# EAGLE design can2usb_v1.3 (EAGLE 5.02)
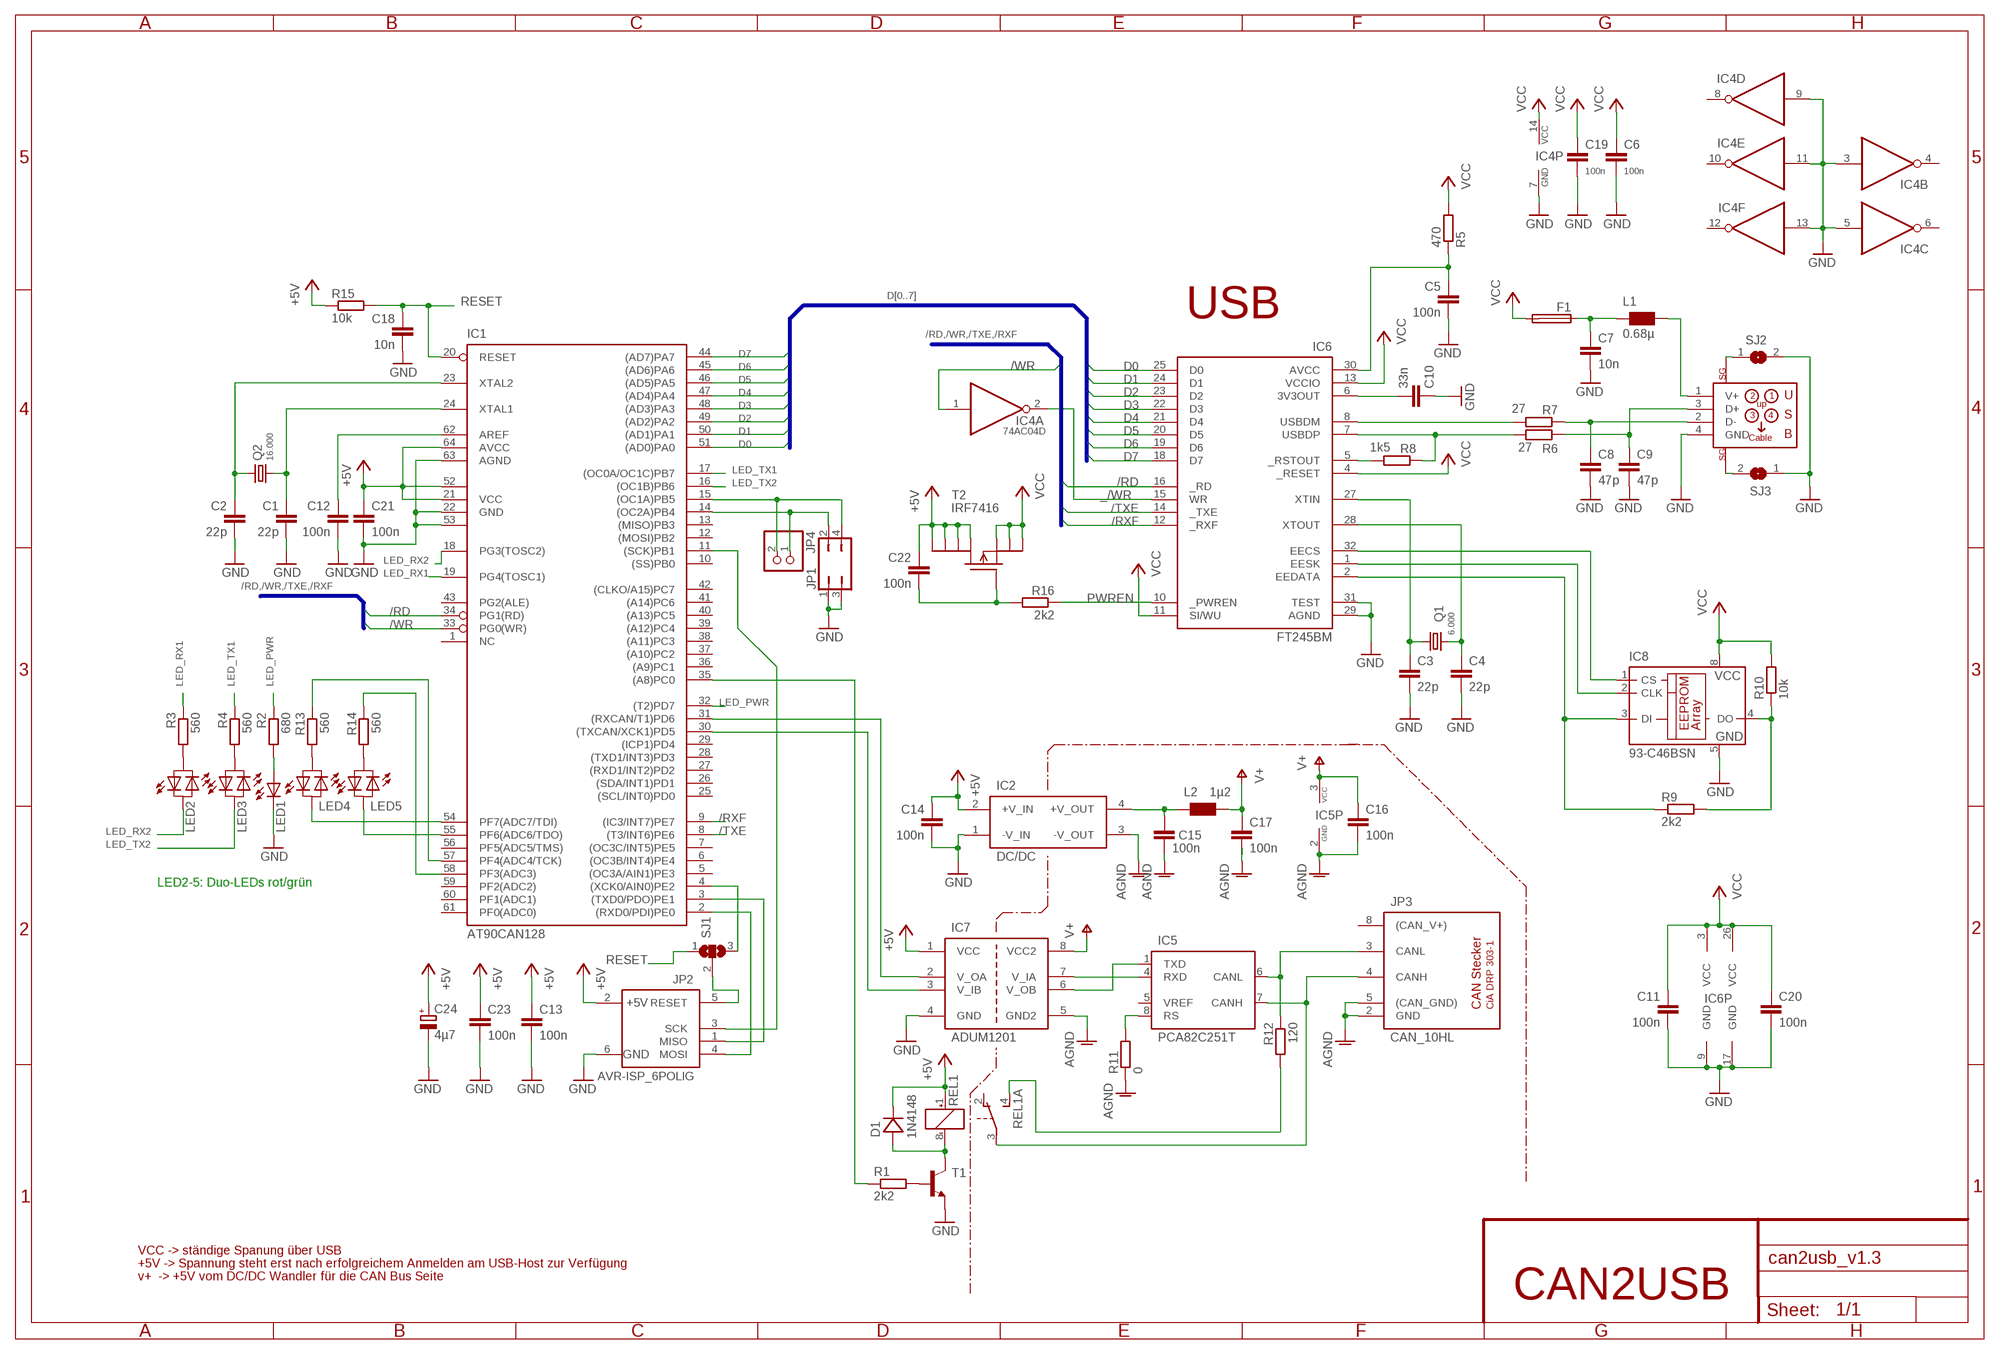
[diagram p0: schematic, sheet 1]

## Parts
C1  22p  C-EUC0805  [C0805]
C2  22p  C-EUC0805  [C0805]
C3  22p  C-EUC0805  [C0805]
C4  22p  C-EUC0805  [C0805]
C5  100n  C-EUC0805  [C0805]
C6  100n  C-EUC0805  [C0805]
C7  10n  C-EUC0805  [C0805]
C8  47p  C-EUC0805  [C0805]
C9  47p  C-EUC0805  [C0805]
C10  33n  C-EUC0805  [C0805]
C11  100n  C-EUC0805  [C0805]
C12  100n  C-EUC0805  [C0805]
C13  100n  C-EUC0805  [C0805]
C14  100n  C-EUC0805  [C0805]
C15  100n  C-EUC0805  [C0805]
C16  100n  C-EUC0805  [C0805]
C17  100n  C-EUC0805  [C0805]
C18  10n  C-EUC0805  [C0805]
C19  100n  C-EUC0805  [C0805]
C20  100n  C-EUC0805  [C0805]
C21  100n  C-EUC0805  [C0805]
C22  100n  C-EUC0805  [C0805]
C23  100n  C-EUC0805  [C0805]
C24  4µ7  CPOL-EU153CLV-0505  [153CLV-0505]
D1  1N4148  DIODESOD80C  [SOD80C]
F1  FUSE  [SMD-HASF]
IC1  AT90CAN128  AT90CAN128B  [SQFP-S-14X14-64]
IC2  DC/DC  [SIL4]
IC4  74AC04D  [SO14]
IC5  PCA82C251T  PCA82C250T  [SO08]
IC6  FT245BM  [LQFP-32]
IC7  ADUM1201  [SO08]
IC8  93-C46BSN  [SO-08]
JP1  JP2Q  [JP2Q]
JP2  AVR-ISP_6POLIG  [2X03]
JP3  CAN_10HL  [ML10L]
JP4  PINHD-1X2S  [1X02S]
L1  0.68µ  WE-KI_0805_B  [WE-KI_0805_B]
L2  1µ2  WE-KI_0805_B  [WE-KI_0805_B]
LED1  LED3MM  [LED3MM]
LED2  DUOLED  [LED3MM]
LED3  DUOLED  [LED3MM]
LED4  DUOLED  [LED3MM]
LED5  DUOLED  [LED3MM]
Q1  6.000  CRYTALSM49  [SM49]
Q2  16.000  CRYTALHC49U-V  [HC49U-V]
R1  2k2  R-EU_M0805  [M0805]
R2  680  R-EU_M0805  [M0805]
R3  560  R-EU_M0805  [M0805]
R4  560  R-EU_M0805  [M0805]
R5  470  R-EU_R0805  [R0805]
R6  27  R-EU_M0805  [M0805]
R7  27  R-EU_M0805  [M0805]
R8  1k5  R-EU_M0805  [M0805]
R9  2k2  R-EU_M0805  [M0805]
R10  10k  R-EU_M0805  [M0805]
R11  0  R-EU_M0805  [M0805]
R12  120  R-EU_R1206  [R1206]
R13  560  R-EU_M0805  [M0805]
R14  560  R-EU_M0805  [M0805]
R15  10k  R-EU_M0805  [M0805]
R16  2k2  R-EU_M0805  [M0805]
REL1  REL_2XUMDIL08SMD  [DIL08SMD]
SJ1  SJ2W  [SJ_2]
SJ2  SJ  [SJ]
SJ3  SJ  [SJ]
T1  NPNSOT23  [SOT23]
T2  IRF7416  MOSFET_P-KANAL_V1SO08  [SO08]
X1  USBCON-BB  [USBCONB]

## Nets
+5V: C13.1 C14.1 C21.1 C22.1 C23.1 C24.+ D1.C(C1) IC1.21(VCC) IC1.52(VCC1) IC1.64(AVCC) IC2.2(+V_IN) IC7.1(VCC) JP2.2(+5V) R15.1 REL1.1(SPULE:+) T2.5(D1) T2.6(D2) T2.7(D3) T2.8(D4)
/RD: IC1.34(PG1(RD)) IC6.16(_RD)
/RXF: IC1.9((IC3/INT7)PE7) IC6.12(_RXF)
/TXE: IC1.8((T3/INT6)PE6) IC6.14(_TXE)
/WR: IC1.33(PG0(WR)) IC4.1(A:I)
_/WR: IC4.2(A:O) IC6.15(WR)
_RXD: IC5.4(RXD) IC7.7(V_IA)
_TXD: IC5.1(TXD) IC7.6(V_OB)
AGND: C15.2 C16.2 C17.2 IC2.3(-V_OUT) IC5.2(GND) IC7.5(GND2) JP3.2(GND) JP3.5((CAN_GND)) R11.1
CANH: IC5.7(CANH) JP3.4(CANH) REL1.3(A:P)
CANL: IC5.6(CANL) JP3.3(CANL) R12.1
D0: IC1.51((AD0)PA0) IC6.25(D0)
D1: IC1.50((AD1)PA1) IC6.24(D1)
D2: IC1.49((AD2)PA2) IC6.23(D2)
D3: IC1.48((AD3)PA3) IC6.22(D3)
D4: IC1.47((AD4)PA4) IC6.21(D4)
D5: IC1.46((AD5)PA5) IC6.20(D5)
D6: IC1.45((AD6)PA6) IC6.19(D6)
D7: IC1.44((AD7)PA7) IC6.18(D7)
DM: C8.1 R7.1 X1.2(D-)
DP: C9.1 R6.1 X1.3(D+)
GND: C1.2 C2.2 C3.2 C4.2 C5.2 C6.2 C7.2 C8.2 C9.2 C10.1 C11.2 C12.2 C13.2 C14.2 C18.2 C19.2 C20.2 C21.2 C23.2 C24.- IC1.22(GND) IC1.53(GND1) IC1.63(AGND) IC2.1(-V_IN) IC4.3(B:I) IC4.5(C:I) IC4.7(P:GND) IC4.9(D:I) IC4.11(E:I) IC4.13(F:I) IC6.9(GND) IC6.17(GND) IC6.29(AGND) IC6.31(TEST) IC7.4(GND) IC8.5(GND) JP1.1 JP1.3 JP2.6(GND) LED1.K(C) SJ2.2 SJ3.1 T1.2(E) X1.4(GND)
LED_ERROR: IC1.57(PF4(ADC4/TCK)) R13.1
LED_OK: IC1.58(PF3(ADC3)) R14.1
LED_PWR: IC1.32((T2)PD7) R2.1
LED_RX1: IC1.19(PG4(TOSC1)) R3.1
LED_RX2: IC1.18(PG3(TOSC2)) LED2.K(C)
LED_TX1: IC1.17((OC0A/OC1C)PB7) R4.1
LED_TX2: IC1.16((OC1B)PB6) LED3.K(C)
MISO: IC1.3((TXD0/PDO)PE1) JP2.1(MISO)
N$1: JP2.5(RESET) SJ1.2
N$2: L1.1 X1.1(V+)
N$3: C22.2 R16.2 T2.4(G)
N$4: IC1.4((XCK0/AIN0)PE2) SJ1.3
N$5: R12.2 REL1.4(A:S)
N$6: D1.A(A1) REL1.8(SPULE:-) T1.3(C)
N$7: R1.2 T1.1(B)
N$8: C2.1 IC1.23(XTAL2) Q2.2
N$9: IC1.35((A8)PC0) R1.1
N$10: C1.1 IC1.24(XTAL1) Q2.1
N$11: C4.1 IC6.28(XTOUT) Q1.2
N$12: LED4.A R13.2
N$13: C3.1 IC6.27(XTIN) Q1.1
N$14: LED5.A R14.2
N$15: LED1.A R2.2
N$16: IC1.55(PF6(ADC6/TDO)) LED5.K(C)
N$17: IC1.54(PF7(ADC7/TDI)) LED4.K(C)
N$18: IC5.8(RS) R11.2
N$19: SJ2.1 X1.S2
N$20: SJ3.2 X1.S1
N$21: C7.1 F1.1 L1.2
N$22: C15.1 IC2.4(+V_OUT) L2.2
N$23: IC6.32(EECS) IC8.1(CS)
N$24: IC6.1(EESK) IC8.2(CLK)
N$25: IC8.4(DO) R9.2 R10.1
N$26: IC6.2(EEDATA) IC8.3(DI) R9.1
N$27: IC1.11((SCK)PB1) JP2.3(SCK)
N$28: C5.1 IC6.30(AVCC) R5.1
N$29: IC1.2((RXD0/PDI)PE0) JP2.4(MOSI)
N$30: C12.1 IC1.62(AREF)
N$31: IC6.8(USBDM) R7.2
N$32: IC6.7(USBDP) R6.2 R8.1
N$33: LED3.A R4.2
N$34: LED2.A R3.2
N$37: IC6.5(_RSTOUT) R8.2
N$38: C10.2 IC6.6(3V3OUT)
PWREN: IC6.10(_PWREN) R16.1
RESET: C18.1 IC1.20(RESET) R15.2 SJ1.1
RXCAN: IC1.31((RXCAN/T1)PD6) IC7.2(V_OA)
SW1: IC1.14((OC2A)PB4) JP1.2 JP4.1
SW2: IC1.15((OC1A)PB5) JP1.4 JP4.2
TXCAN: IC1.30((TXCAN/XCK1)PD5) IC7.3(V_IB)
V+: C16.1 C17.1 IC5.3(VCC) IC7.8(VCC2) L2.1
VCC: C6.1 C11.1 C19.1 C20.1 F1.2 IC4.14(P:VCC) IC6.3(VCC) IC6.4(_RESET) IC6.11(SI/WU) IC6.13(VCCIO) IC6.26(VCC) IC8.8(VCC) R5.2 R10.2 T2.1(S1) T2.2(S2) T2.3(S3)
Unconnected: IC1.1(NC) IC1.5((OC3A/AIN1)PE3) IC1.6((OC3B/INT4)PE4) IC1.7((OC3C/INT5)PE5) IC1.10((SS)PB0) IC1.12((MOSI)PB2) IC1.13((MISO)PB3) IC1.25((SCL/INT0)PD0) IC1.26((SDA/INT1)PD1) IC1.27((RXD1/INT2)PD2) IC1.28((TXD1/INT3)PD3) IC1.29((ICP1)PD4) IC1.36((A9)PC1) IC1.37((A10)PC2) IC1.38((A11)PC3) IC1.39((A12)PC4) IC1.40((A13)PC5) IC1.41((A14)PC6) IC1.42((CLKO/A15)PC7) IC1.43(PG2(ALE)) IC1.56(PF5(ADC5/TMS)) IC1.59(PF2(ADC2)) IC1.60(PF1(ADC1)) IC1.61(PF0(ADC0)) IC4.4(B:O) IC4.6(C:O) IC4.8(D:O) IC4.10(E:O) IC4.12(F:O) IC5.5(VREF) JP3.8((CAN_V+)) REL1.2(A:O) REL1.5(B:S) REL1.6(B:P) REL1.7(B:O)

## Buses
D[0..7]
/RD,/WR,/TXE,/RXF

## Notes on the sheet
- USB
- LED2-5: Duo-LEDs rot/grün
- VCC -> ständige Spanung über USB
- +5V -> Spannung steht erst nach erfolgreichem Anmelden am USB-Host zur Verfügung
- v+  -> +5V vom DC/DC Wandler für die CAN Bus Seite
- CAN2USB

## Library data of the parts
C1-C23 = rcl:C-EU: CAPACITOR, European symbol
C24 = rcl:CPOL-EU: POLARIZED CAPACITOR, European symbol
D1 = BV_dioden:DIODE
F1 = rca_sontiges:FUSE: SMD Fuse
IC1 = avr:AT90CAN128: MICROCONTROLLER 128 Kbytes FLASH 4 Kbytes SRAM 4 Kbytes EEPROM DUAL USART 8-channel 10 bit ADC CAN 2.0 A&B Interface
IC2 = rca_spgversorgung:DC/DC
IC4 = 74xx-eu:74*04: Hex INVERTER
IC5 = andereBauteile:PCA82C250: PCA82C250 CAN Bustreiber
IC6 = ftdi:FT245BM: USB FIFO 2nd Generation USB FIFO (USB <-> Parallel)
IC7 = rca_opto:ADUM1201: ADuM1201 Dual-Channel Digital Isolators zu beziehen per Sample oder bei Farnell
IC8 = microchip:93-*: Serial EEPROM 512 x 8 bit/256 x 16 bit/1 K/4 K, 5.0 V, Microwire
JP1 = jumper:JP2Q: JUMPER
JP2 = stecker-definitionen:AVR-ISP_6POLIG: ISP (In System Programming) Stecker für AVRs Über diesen Anschluß kann ein AVR mit einem Standard ISP-Kabel direkt an einen Parallelport des PC´s angeschlossen und programmiert werden.
JP3 = stecker-definitionen:CAN_: CAN Stecker nach CiA DRP 303-1
JP4 = pinhead:PINHD-1X2: PIN HEADER
L1 L2 = wuerth-elektronik:WE-KI: SMD Wire Wound Ceramic Inductor WE-KI - Wire wound - High thermal stability - Rated current up to 1 A - High Q-factor - High SRF -- Especially developed for high frequency applications -- Perfect for applications in telecommunications -- Bluetooth -- Wireless LAN
LED1 = led:LED: LED OSRAM: - CHIPLED LG R971, LG N971, LY N971, LG Q971, LY Q971, LO R971, LY R971 LH N974, LH R974 LS Q976, LO Q976, LY Q976 LO Q996 - Hyper CHIPLED LW Q18S LB Q993, LB Q99A, LB R99A - SideLED LS A670, LO A670, LY A670, LG A670, LP A670 LB A673, LV A673, LT A673, LW A673 LH A674 LY A675 LS A676, LA A676, LO A676, LY A676, LW A676 LS A679, LY A679, LG A679 - Hyper Micro SIDELED® LS Y876, LA Y876, LO Y876, LY Y876 LT Y87S - SmartLED LW L88C, LW L88S LB L89C, LB L89S, LG L890 LS L89K, LO L89K, LY L89K LS L896, LA L896, LO L896, LY L896 - TOPLED LS T670, LO T670, LY T670, LG T670, LP T670 LSG T670, LSP T670, LSY T670, LOP T670, LYG T670 LG T671, LOG T671, LSG T671 LB T673, LV T673, LT T673, LW T673 LH T674 LS T676, LA T676, LO T676, LY T676, LB T676, LH T676, LSB T676, LW T676 LB T67C, LV T67C, LT T67C, LS T67K, LO T67K, LY T67K, LW E67C LS E67B, LA E67B, LO E67B, LY E67B, LB E67C, LV E67C, LT E67C LW T67C LS T679, LY T679, LG T679 LS T770, LO T770, LY T770, LG T770, LP T770 LB T773, LV T773, LT T773, LW T773 LH T774 LS E675, LA E675, LY E675, LS T675 LS T776, LA T776, LO T776, LY T776, LB T776 LHGB T686 LT T68C, LB T68C - Hyper Mini TOPLED® LB M676 - Mini TOPLED Santana® LG M470 LS M47K, LO M47K, LY M47K Source: http://www.osram.convergy.de - LUMILED® LXK2-PW12-R00, LXK2-PW12-S00, LXK2-PW14-U00, LXK2-PW14-V00 LXK2-PM12-R00, LXK2-PM12-S00, LXK2-PM14-U00 LXK2-PE12-Q00, LXK2-PE12-R00, LXK2-PE12-S00, LXK2-PE14-T00, LXK2-PE14-U00 LXK2-PB12-K00, LXK2-PB12-L00, LXK2-PB12-M00, LXK2-PB14-N00, LXK2-PB14-P00, LXK2-PB14-Q00 LXK2-PR12-L00, LXK2-PR12-M00, LXK2-PR14-Q00, LXK2-PR14-R00 LXK2-PD12-Q00, LXK2-PD12-R00, LXK2-PD12-S00 LXK2-PH12-R00, LXK2-PH12-S00 LXK2-PL12-P00, LXK2-PL12-Q00, LXK2-PL12-R00 Source: www.luxeon.com
LED2-LED5 = rca_opto:DUOLED
Q1 Q2 = crystal:CRYTAL: CRYSTAL
R1-R16 = rcl:R-EU_: RESISTOR, European symbol
REL1 = BV_sonstiges:REL_2XUM
SJ1 = jumper:SJ2W: SMD solder JUMPER
SJ2 SJ3 = jumper:SJ: SMD solder JUMPER
T1 = BV_transistoren:NPN
T2 = BV_transistoren:MOSFET_P-KANAL_V1
X1 = USB:USBCON-B: USB-Contector B-Type

## Board
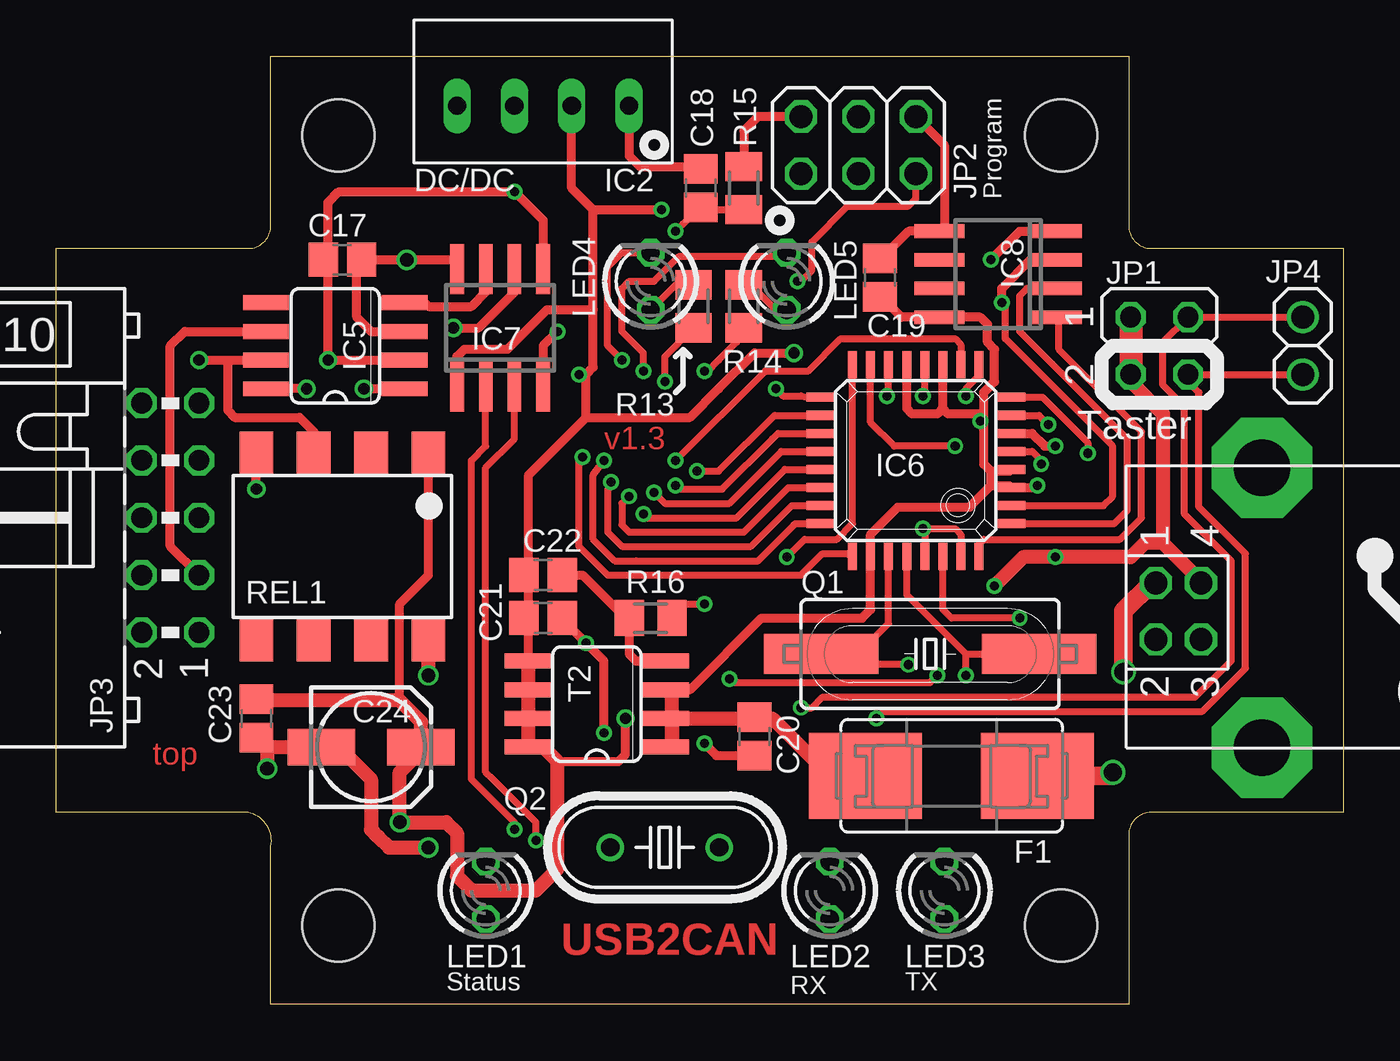
[diagram p1: board, top side]
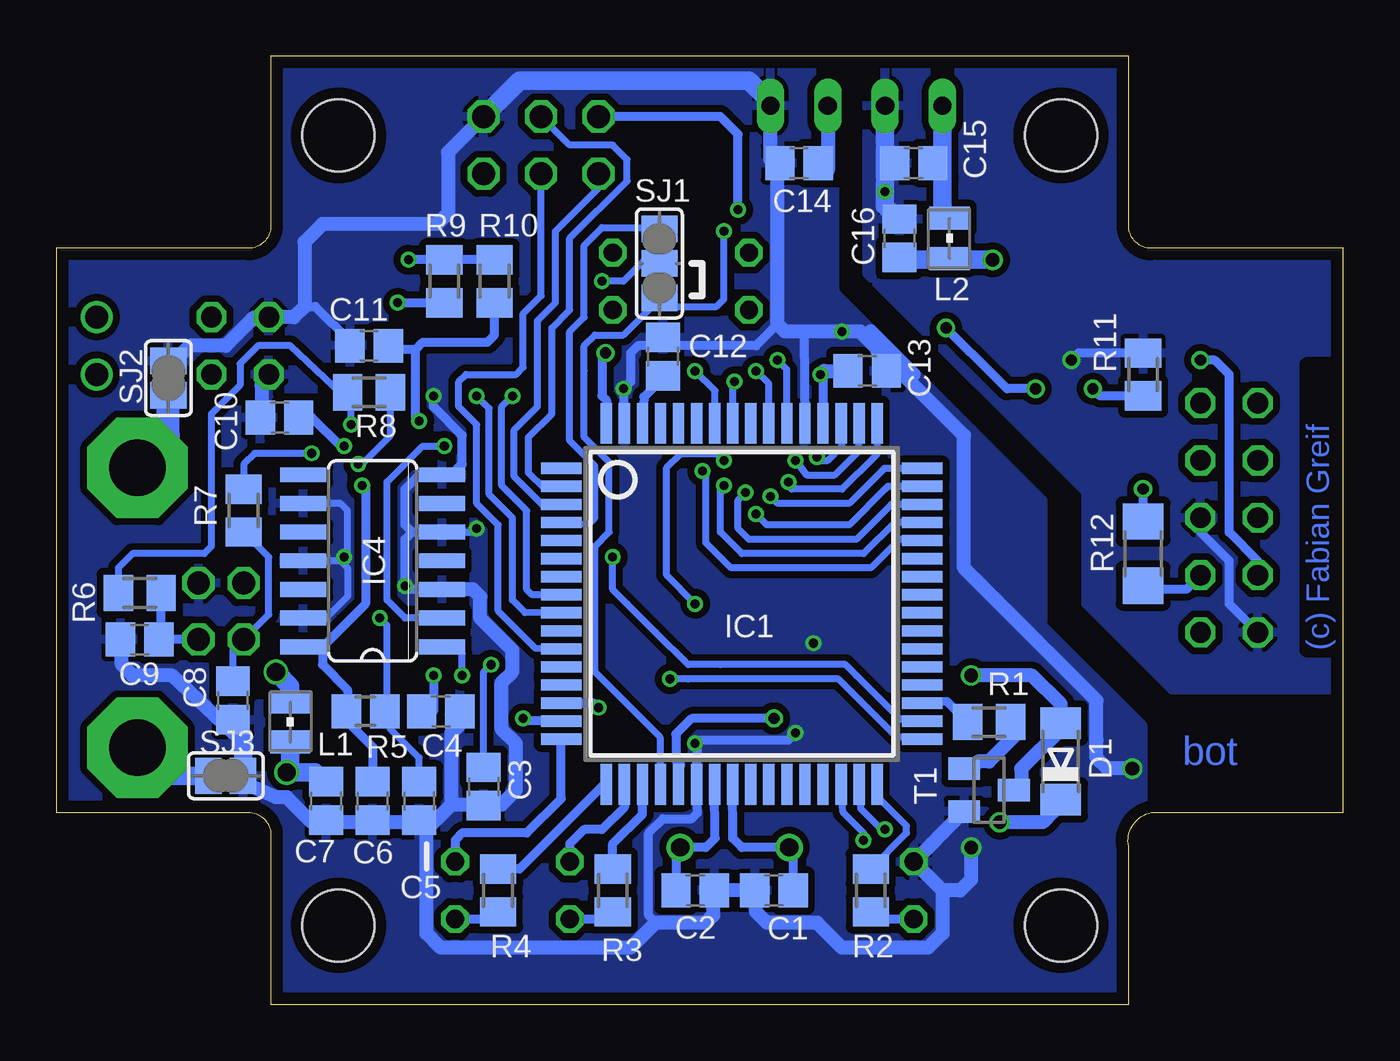
[diagram p2: board, bottom side, seen from below]

Size 57 x 42 mm. Coordinates in mm from the lower left corner, seen from the top.
Outline: 0,33.5 8.5,33.5 arc90 9.5,34.5 9.5,42 47.5,42 47.5,34.5 arc90 48.5,33.5 57,33.5 57,8.5 48.5,8.5 arc90 47.5,7.5 47.5,0 9.5,0 9.5,7 arc90 8.5,8.5 0,8.5 0,33.5
Copper layers (1*16): Top 0.035mm / dielectric 1.5mm / Bottom 0.035mm
Design rules "PCB-POOL": minimum track width 6mil, minimum drill 12mil, track to track 6mil, track to pad 6mil, pad to pad 6mil, via to via 6mil, smd to smd 6mil, copper to edge 20mil, drill to drill 8mil, minimum pad ring 8mil, minimum via ring 6mil, stop-mask expansion 3mil, vias tented up to drill 20mil, thermal gap 8mil
Holes 3.2 mm at 12.5,38.5 44.5,38.5 12.5,3.5 44.5,3.5

### Footprints (pad centres in the part's own frame; a part is rotated, then mirrored left to right if it is on the bottom)
C0805 = smd 1.3 x 1.5: 1 -0.85,0; 2 0.85,0
153CLV-0505 = smd 3 x 1.6: + 2.2,0; - -2.2,0
SOD80C = smd 1.4 x 1.8: A 1.7,0; C -1.7,0
SMD-HASF = smd 5 x 3.81: 1 -3.81,0; 2 3.81,0
SQFP-S-14X14-64 = smd 0.5 x 1.8: 1 -6,-8; 2 -5.2,-8; 3 -4.4,-8; 4 -3.6,-8; 5 -2.8,-8; 6 -2,-8; 7 -1.2,-8; 8 -0.4,-8; 9 0.4,-8; 10 1.2,-8; 11 2,-8; 12 2.8,-8; 13 3.6,-8; 14 4.4,-8; 15 5.2,-8; 16 6,-8; 33 6,8; 34 5.2,8; 35 4.4,8; 36 3.6,8; 37 2.8,8; 38 2,8; 39 1.2,8; 40 0.4,8; 41 -0.4,8; 42 -1.2,8; 43 -2,8; 44 -2.8,8; 45 -3.6,8; 46 -4.4,8; 47 -5.2,8; 48 -6,8 | smd 1.8 x 0.5: 17 8,-6; 18 8,-5.2; 19 8,-4.4; 20 8,-3.6; 21 8,-2.8; 22 8,-2; 23 8,-1.2; 24 8,-0.4; 25 8,0.4; 26 8,1.2; 27 8,2; 28 8,2.8; 29 8,3.6; 30 8,4.4; 31 8,5.2; 32 8,6; 49 -8,6; 50 -8,5.2; 51 -8,4.4; 52 -8,3.6; 53 -8,2.8; 54 -8,2; 55 -8,1.2; 56 -8,0.4; 57 -8,-0.4; 58 -8,-1.2; 59 -8,-2; 60 -8,-2.8; 61 -8,-3.6; 62 -8,-4.4; 63 -8,-5.2; 64 -8,-6
SIL4 = drill 0.813 long: 1 -3.81,0; 2 -1.27,0; 3 1.27,0; 4 3.81,0
SO14 = smd 0.66 x 2.032: 1 -3.81,-3.073; 2 -2.54,-3.073; 3 -1.27,-3.073; 4 0,-3.073; 5 1.27,-3.073; 6 2.54,-3.073; 7 3.81,-3.073; 8 3.81,3.073; 9 2.54,3.073; 10 1.27,3.073; 11 0,3.073; 12 -1.27,3.073; 13 -2.54,3.073; 14 -3.81,3.073
SO08 = smd 0.66 x 2.032: 1 -1.905,-3.073; 2 -0.635,-3.073; 3 0.635,-3.073; 4 1.905,-3.073; 5 1.905,3.073; 6 0.635,3.073; 7 -0.635,3.073; 8 -1.905,3.073
LQFP-32 = smd 0.4 x 1.2: 1 -2.8,-4.25; 2 -2,-4.25; 3 -1.2,-4.25; 4 -0.4,-4.25; 5 0.4,-4.25; 6 1.2,-4.25; 7 2,-4.25; 8 2.8,-4.25; 17 2.8,4.25; 18 2,4.25; 19 1.2,4.25; 20 0.4,4.25; 21 -0.4,4.25; 22 -1.2,4.25; 23 -2,4.25; 24 -2.8,4.25 | smd 1.2 x 0.4: 9 4.25,-2.8; 10 4.25,-2; 11 4.25,-1.2; 12 4.25,-0.4; 13 4.25,0.4; 14 4.25,1.2; 15 4.25,2; 16 4.25,2.8; 25 -4.25,2.8; 26 -4.25,2; 27 -4.25,1.2; 28 -4.25,0.4; 29 -4.25,-0.4; 30 -4.25,-1.2; 31 -4.25,-2; 32 -4.25,-2.8
SO08' = smd 0.6 x 2.2: 1 -1.905,-2.6; 2 -0.635,-2.6; 3 0.635,-2.6; 4 1.905,-2.6; 5 1.905,2.6; 6 0.635,2.6; 7 -0.635,2.6; 8 -1.905,2.6
SO-08 = smd 0.6 x 2.2: 1 -1.905,-2.6; 2 -0.635,-2.6; 3 0.635,-2.6; 4 1.905,-2.6; 5 1.905,2.6; 6 0.635,2.6; 7 -0.635,2.6; 8 -1.905,2.6
JP2Q = drill 0.914 octagon: 1 -1.27,-1.27; 2 -1.27,1.27; 3 1.27,-1.27; 4 1.27,1.27
2X03 = drill 1.016 octagon: 1 -2.54,-1.27; 2 -2.54,1.27; 3 0,-1.27; 4 0,1.27; 5 2.54,-1.27; 6 2.54,1.27
ML10L = drill 0.914 octagon: 1 -5.08,-1.27; 2 -5.08,1.27; 3 -2.54,-1.27; 4 -2.54,1.27; 5 0,-1.27; 6 0,1.27; 7 2.54,-1.27; 8 2.54,1.27; 9 5.08,-1.27; 10 5.08,1.27
1X02S = drill 1.016 round: 1 -1.27,0; 2 1.27,0
WE-KI_0805_B = smd 1.02 x 1.78: 1 -0.89,0; 2 0.89,0
LED3MM = drill 0.813 octagon: A -1.27,0; K 1.27,0
SM49 = smd 5.08 x 1.778: 1 -4.826,0; 2 4.826,0
HC49U-V = drill 0.813 round: 1 -2.413,0; 2 2.413,0
M0805 = smd 1.3 x 1.6: 1 -0.95,0; 2 0.95,0
R0805 = smd 1.3 x 1.5: 1 -0.85,0; 2 0.85,0
R1206 = smd 1.6 x 1.803: 1 -1.422,0; 2 1.422,0
DIL08SMD = smd 1.5 x 1.9: 1 -3.81,-4.15; 2 -1.27,-4.15; 3 1.27,-4.15; 4 3.81,-4.15; 5 3.81,4.15; 6 1.27,4.15; 7 -1.27,4.15; 8 -3.81,4.15
SJ_2 = smd 1.168 x 1.6: 1 -1.524,0; 2 0,0; 3 1.524,0
SJ = smd 1.168 x 1.6: 1 -0.762,0; 2 0.762,0
SOT23 = smd 1 x 1.4: 1 -0.95,-1.1; 2 0.95,-1.1; 3 0,1.1
USBCONB = drill 1.016 octagon: 1 7.3,4.7; 2 4.8,4.7; 3 4.8,2.7; 4 7.3,2.7 | drill 2.5 pad 4.445 octagon: S1 0,0; S2 12.4,0

### Placement (x,y rotation side)
C1  25.21,5.05 180 bottom
C2  28.7,5.05 0 bottom
C3  38.07,9.65 270 bottom
C4  39.97,12.99 0 bottom
C5  40.93,9.02 270 bottom
C6  42.99,9.02 270 bottom
C7  45.05,9.02 270 bottom
C8  49.18,13.46 270 bottom
C9  53.31,16.16 180 bottom
C10  47.12,26 0 bottom
C11  43.15,29.18 180 bottom
C12  30.13,28.7 90 bottom
C13  21.08,28.07 0 bottom
C14  24.1,37.28 180 bottom
C15  19.02,37.28 180 bottom
C16  19.65,33.94 90 bottom
C17  12.67,32.99 180 top
C18  28.54,36.16 90 top
C19  36.48,32.2 90 top
C20  30.92,11.88 270 top
C21  21.56,17.11 0 top
C22  21.56,19.02 0 top
C23  8.86,12.67 270 top
C24  13.94,11.4 0 top
D1  12.51,10.76 90 bottom
F1  39.66,10.13 180 top
IC1  26.64,17.75 270 bottom
IC2  21.56,39.82 180 top
IC4  42.99,19.65 90 bottom
IC5  12.35,29.18 90 top
IC6  38.07,24.1 90 top
IC7  ADUM1201  [SO08']  19.65,29.97 0 top
IC8  41.72,32.35 90 top
JP1  48.86,29.18 270 top
JP2  35.53,38.07 0 top
JP3  5.05,21.56 90 top
JP4  55.21,29.18 270 top
L1  46.64,12.51 270 bottom
L2  17.43,33.94 90 bottom
LED1  19.02,5.05 90 top
LED2  34.26,5.05 90 top
LED3  39.34,5.05 90 top
LED4  26.32,32.04 90 top
LED5  32.35,32.04 90 top
Q1  38.7,15.53 0 top
Q2  26.96,6.95 0 top
R1  15.69,12.51 0 bottom
R2  20.92,5.05 270 bottom
R3  32.35,5.05 270 bottom
R4  37.43,5.05 270 bottom
R5  43.31,12.99 180 bottom
R6  53.31,18.23 180 bottom
R7  48.7,21.88 90 bottom
R8  43.15,27.12 0 bottom
R9  39.81,32.04 90 bottom
R10  37.59,32.04 270 bottom
R11  8.86,27.91 270 bottom
R12  8.86,19.97 90 bottom
R13  28.23,30.93 90 top
R14  30.45,30.93 90 top
R15  30.45,36.16 270 top
R16  26.32,17.11 180 top
REL1  12.67,20.29 180 top
SJ1  30.29,32.83 90 bottom
SJ2  52.04,27.75 90 bottom
SJ3  49.5,10.13 180 bottom
T1  15.68,9.49 270 bottom
T2  23.94,13.3 90 top
X1  53.41,11.37 90 top

### Tracks (layer width: path | path; a pad name or v marks a point on that pad's centre or on a via)
+5V  (via drill 0.4, 0.5, 0.6)
  Top 0.406: REL1.1 16.48,19.02 15.21,17.75 15.21,13.46 | v25.21,12.67 25.21,12.19 25.21,11.08 24.89,10.76 22.19,10.76 | v25.21,12.67 | 23.46,27.91 23.78,28.23 23.78,30.77 | 23.78,30.77 23.78,35.21 | 23.78,35.21 22.83,36.16 IC2.2 22.83,40.13 | 20.92,15.21 20.92,16.8 20.61,17.11 C21.1 20.92,17.11 20.92,19.02 | 23.46,26 23.46,27.91 | 23.46,27.91 v23.15,27.91 | 29.34,27.27 28.07,26 23.46,26 | 29.34,27.27 | 29.34,27.27 30.92,28.86 v32.67,28.86 | C22.1 20.71,19.23 20.92,19.02 | 20.92,19.02 20.92,23.46 23.46,26 | 8.86,13.46 C23.1 | JP2.2 31.08,39.34 30.45,38.7 R15.1 | 23.78,35.21 v26.8,35.21 | IC7.1 17.75,28.7 18.07,29.02 19.97,29.02 21.72,30.77 23.78,30.77
  Top 0.61: 20.92,11.4 T2.8 | 20.92,11.4 20.92,12.67 | 20.92,12.67 T2.7 | 20.92,12.67 20.92,13.94 | 20.92,13.94 T2.6 | T2.5 20.92,15.21 20.92,13.94 | 20.92,11.4 21.56,11.4 22.19,10.76 22.19,6 21.24,5.05 18.38,5.05 17.75,5.68 17.75,7.59 17.27,8.06 v15.21,8.06 15.21,10.29 16.32,11.4 C24.+ 16.14,11.53 16.16,11.56 16.16,12.51 15.21,13.46 8.86,13.46
  Bottom 0.406: v25.21,12.67 28.86,12.67 29.55,11.98 29.55,10.82 29.34,10.6 29.39,10.55 IC1.21 | IC1.52 23.04,27.8 v23.15,27.91 23.1,27.86 | IC1.64 32.64,26.76 32.83,26.96 32.83,28.7 32.7,28.83 32.64,28.83 v32.67,28.86 | v26.8,35.21 26.8,38.54 27.59,39.34 JP2.2
  Bottom 0.61: C14.1 23.25,37.01 22.83,36.96 IC2.2 | D1.C 12.83,8.54 13.3,8.06 v15.21,8.06 | C13.1 22.99,28.07 v23.15,27.91
/RD  (via drill 0.4)
  Top 0.305: IC6.16 35.27,21.3 34.58,20.61 33.15,20.61 v32.35,19.81
  Bottom 0.305: IC1.34 19.62,12.63 21.56,14.57 22.03,15.05 27.59,15.05 29.02,15.05 30.45,16.48 31.72,17.75 32.35,18.38 | 32.35,18.38 v32.35,19.81 | 32.35,18.38
/RXF  (via drill 0.4)
  Top 0.305: IC6.12 38.47,27.04 v38.39,26.96
  Bottom 0.305: IC1.9 36.25,17.35 36.8,17.91 36.8,21.56 37.83,22.59 37.83,26.4 v38.39,26.96
/TXE  (via drill 0.4)
  Top 0.305: IC6.14 36.87,27.03 v36.8,26.96
  Bottom 0.305: IC1.8 35.92,18.14 36.16,18.38 36.16,21.88 37.27,22.99 37.27,26.48 v36.8,26.96
/WR  (via drill 0.4)
  Top 0.305: v29.81,14.41 29.97,14.26 33.31,14.26 33.62,14.26 38.7,14.26 v39.02,14.57
  Bottom 0.305: IC1.33 19.78,11.84 22.35,14.41 29.02,14.41 29.5,14.41 v29.81,14.41 | v39.02,14.57 39.02,15.53 39.34,15.84 IC4.1
  Bottom 0.406: IC4.1 39.66,15.84
_/WR  (via drill 0.4)
  Top 0.305: IC6.15 36.07,25.78 37.12,24.73 v39.81,24.73
  Bottom 0.305: 39.34,17.11 IC4.2 41.56,17.11 42.35,17.91 42.35,23.15 40.77,24.73 v39.81,24.73
_RXD
  Top 0.406: IC7.7 19.02,31.56 18.38,30.92 16.48,30.92 16.32,31.08 IC5.4
_TXD  (via drill 0.5)
  Top 0.406: 15.84,27.27 IC5.1 v13.62,27.27 | v17.59,29.97 18.7,29.97 20.29,31.56 IC7.6 20.29,32.67
  Bottom 0.406: v13.62,27.27 14.89,27.27 15.37,27.75 v17.59,29.97
AGND  (via drill 0.4, 0.5)
  Top 0.406: IC5.2 v12.03,28.54 12.03,32.99 | IC7.5 21.56,34.73 v20.29,36 12.51,36 12.03,35.53 12.03,32.99 | 12.03,32.99 C17.2
  Bottom 0.406: IC2.3 20.29,38.7 | JP3.2 5.05,17.75 5.05,19.65 6.32,20.92 JP3.5 | v12.03,28.54 11.72,28.86 9.02,28.86 8.86,28.7 R11.1
  Bottom 0.61: 20.29,36.64 C15.2
  Bottom 0.813: 20.29,38.86 IC2.3 20.29,36.64 v20.29,36 20.29,35.37 19.97,35.05 C16.2
  pour Bottom (isolate 0.305): -1.3,13.94 7.59,13.94 11.4,17.75 11.4,22.67 21.08,32.35 21.08,43.15 -1.3,43.15
CANH  (via drill 0.5)
  Top 0.406: v6.32,28.54 7.59,28.54 | 7.59,28.54 IC5.7 | REL1.3 11.4,25.37 10.76,26 7.91,26 7.59,26.32 7.59,28.54
  Bottom 0.406: v6.32,28.54 5.68,28.54 5.05,27.91 5.05,20.92 3.78,19.65 JP3.4
CANL
  Top 0.406: IC5.6 5.68,29.81 5.05,29.18 5.05,20.29 JP3.3
  Bottom 0.406: R12.1 8.86,18.38 6.95,18.38 JP3.3
D0  (via drill 0.4)
  Top 0.305: IC6.25 35.17,19.85 35.05,19.97 33.94,19.97 32.99,19.02 24.42,19.02 23.15,20.29 23.15,24.1 v23.3,24.26
  Bottom 0.305: IC1.51 22.31,25.48 22.19,25.37 22.19,24.73 22.83,24.1 23.15,24.1 v23.3,24.26
D1  (via drill 0.4)
  Top 0.305: IC6.24 32.73,21.3 32.67,21.24 31.08,19.65 25.69,19.65 24.73,19.65 23.78,20.61 23.78,23.46 v24.26,24.1
  Bottom 0.305: 21.56,24.42 22.51,23.46 23.78,23.46 v24.26,24.1 | 21.56,24.42 21.52,24.45 | IC1.50 21.44,24.54 21.56,24.42
D2  (via drill 0.4)
  Top 0.305: IC6.23 32.58,22.1 30.77,20.29 25.05,20.29 24.42,20.92 24.42,22.83 v24.57,23.15
  Bottom 0.305: 20.76,24.26 22.19,22.83 24.42,22.83 v24.57,23.15 | 20.76,24.26 20.73,24.29 | 20.76,24.26 | IC1.49 20.64,24.38 20.76,24.26
D3  (via drill 0.4)
  Top 0.305: IC6.22 32.42,22.9 30.45,20.92 25.37,20.92 25.05,21.24 25.05,22.19 v25.37,22.51
  Bottom 0.305: 20.42,23.65 21.88,22.19 25.05,22.19 v25.37,22.51 | IC1.48 20.32,23.75 20.42,23.65 | 20.42,23.65 | 20.42,23.65 20.45,23.62
D4  (via drill 0.4)
  Top 0.305: IC6.21 32.27,23.7 30.13,21.56 26.16,21.56 v26,21.72
  Bottom 0.305: 20.29,22.83 21.88,21.24 25.53,21.24 25.69,21.4 v26,21.72 | 20.29,22.83 20.25,22.87 | IC1.47 20.17,22.95 20.29,22.83
D5  (via drill 0.4)
  Top 0.305: IC6.20 32.12,24.5 32.04,24.42 29.81,22.19 26.96,22.19 v26.48,22.67
  Bottom 0.305: 20.13,22.03 20.09,22.08 | 20.13,22.03 21.56,20.61 26.32,20.61 26.8,21.08 26.8,22.35 v26.48,22.67 | 20.13,22.03 | IC1.46 20.02,22.15 20.13,22.03
D6  (via drill 0.4)
  Top 0.305: IC6.19 31.97,25.3 31.72,25.05 29.5,22.83 27.59,22.83 v27.43,22.99
  Bottom 0.305: v27.43,22.99 27.59,22.99 27.59,20.92 26.64,19.97 21.24,19.97 19.86,21.35 IC1.45
D7  (via drill 0.4)
  Top 0.305: IC6.18 31.81,26.1 29.34,23.62 | v28.38,23.62 29.34,23.62 | 29.34,23.62
  Bottom 0.305: IC1.44 18.92,20.5 19.02,20.61 19.65,20.61 20.92,19.34 27.11,19.34 28.23,20.45 28.23,23.3 28.23,23.46 v28.38,23.62
DM
  Bottom 0.305: R7.1 47.59,19.81 47.59,17.27 X1.2 | X1.2 | C8.1 49.18,15.68 X1.2
DP
  Bottom 0.406: X1.3 50.76,16.17 50.77,16.16 52.36,16.16 | 52.36,16.16 C9.1 | R6.1 52.36,16.16
GND  (via drill 0.4, 0.6)
  Top 0.305: 38.47,20.85 IC6.29 | 38.47,20.85 38.7,21.08 39.81,21.08 40.07,20.83 IC6.31 | IC6.17 33.25,26.9 32.99,26.96 32.19,26.96 v31.88,27.27 | IC6.9 40.87,27.85 40.29,27.27 v40.29,26.96 | 38.47,20.85 38.46,20.85 v38.39,21.08
  Top 0.406: v22.19,29.81 21.56,29.18 IC7.4 | C18.2 28.54,37.12 25.84,37.12 25.37,37.59 IC2.1 | v24.26,12.03 24.26,15.21 v23.46,16 22.51,16.95 C21.2 | JP2.6 39.34,38.07 39.34,34.42 39.18,34.26 IC8.5 37.75,34.26 36.48,32.99 | 36.48,32.99 | 36.48,32.99 C19.2 | JP1.3 47.59,27.59 | C20.2 29.23,11.02 v28.7,11.56
  Top 0.61: 50.73,18.67 X1.4 | 50.77,18.7 49.02,20.45 | 47.59,27.59 49.02,26.16 49.02,20.45 | 49.02,20.45 48.23,20.45 47.59,19.81 v44.26,19.81 42.83,19.81 v41.56,18.54 | C23.2 8.91,11.82 9.33,11.4 | 9.33,11.4 C24.- 12.51,11.4 13.94,9.97 13.94,7.75 14.26,7.43 14.73,6.95 v16.48,6.95 | 9.33,11.4 v9.33,10.45
  Top 0.813: 50.77,18.7 50.73,18.67
  Top 1.016: 47.43,30.45 | JP1.1 47.43,30.45 | JP1.3 | JP1.3 47.59,30.29 47.43,30.45
  Bottom 0.305: IC1.63 31.92,25.65 31.88,25.69 | 39.34,20.92 IC4.5 39.97,20.92 38.54,20.92 v38.39,21.08 | 40.93,23.46 39.5,23.46 | IC4.9 44.42,22.19 44.1,21.88 44.1,19.97 44.42,19.65 | 44.42,19.65 IC4.11 | IC4.13 45.05,17.11 44.1,18.07 44.1,19.34 44.42,19.65 | v44.26,19.81 | v44.26,19.81 44.42,19.65
  Bottom 0.406: 31.88,25.69 v31.88,27.27 31.56,27.59 31.56,28.86 31.24,29.18 30.45,29.18 | 30.45,29.18 C12.2 | v24.26,12.03 24.57,11.72 28.54,11.72 v28.7,11.56 28.61,11.34 IC1.22 28.61,8.48 28.86,8.22 30.13,8.22 30.77,7.59 30.77,3.94 30.45,3.62 | 25.05,30.13 26,29.18 30.45,29.18 | 24.1,29.81 23.88,29.6 IC1.53 | 39.97,18.38 41.4,18.38 v41.56,18.54 41.56,20.61 41.24,20.92 | 41.24,20.92 39.97,20.92 | IC4.7 40.93,23.46 41.56,22.83 41.56,21.24 41.24,20.92 | v40.29,26.96 40.29,26.48 39.02,25.21 39.02,23.94 39.5,23.46 | 41.24,20.92 | 45.37,8.06 45.05,8.08 | 45.05,8.08 C6.2 | 46.01,30.92 45.53,30.92 43.94,29.34 C11.2 | 45.05,8.08 45.05,8.22 C7.2 | JP1.3
  Bottom 0.61: 49.18,12.03 48.86,12.03 48.74,11.91 48.7,11.87 48.7,9.81 47.28,9.18 46.8,9.18 45.69,8.06 45.37,8.06 41.72,8.06 41.4,8.06 C5.2 40.93,8.07 40.93,8.06 40.61,7.75 | 49.18,12.03 51.88,14.57 53.63,14.57 54.1,15.05 54.1,15.84 54.26,16.16 C9.2 | 31.56,2.51 39.97,2.51 40.61,3.14 40.61,7.75 | 31.56,2.51 30.45,3.62 28.23,3.62 27.91,3.94 27.91,5.05 C2.2 C1.2 26,5.05 26,4.1 25.53,3.62 23.3,3.62 22.19,2.51 18.38,2.51 17.75,3.14 17.75,5.05 | 31.56,2.51 | 17.75,5.05 LED1.K | LED1.K | LED1.K 18.22,7.11 | JP2.6 39.66,37.75 39.66,35.05 40.13,34.58 45.21,34.58 46.01,33.78 46.01,30.92 46.48,30.45 JP1.1 | IC4.3 39.97,18.38 38.54,18.38 38.23,18.07 38.23,17.11 36.8,15.68 36.8,14.73 37.27,14.26 37.27,12.19 36.64,11.56 36.64,9.49 37.27,8.86 38.07,8.86 C3.2 38.33,8.8 | 49.18,12.35 49.18,12.03 | C10.1 47.91,26 47.91,27.43 47.59,27.75 JP1.3 | 25.21,37.27 25.37,37.43 IC2.1 | 25.21,37.27 25.05,37.59 25.05,30.13 24.73,29.81 24.1,29.81 v22.19,29.81 21.4,29.81 19.65,28.07 | C14.2 24.95,36.7 25.21,37.27 | 16.8,19.34 16.8,25.21 19.65,28.07 | 51.75,28.51 51.09,29.18 49.5,29.18 48.39,30.29 | 48.39,30.29 | 48.39,30.29 48.23,30.45 JP1.1 | JP1.1 | 40.61,7.75 39.5,8.86 | C4.2 38.96,13.25 38.86,12.67 39.5,12.03 39.5,8.86 | 40.61,7.75 | 38.33,8.8 37.97,8.8 | 38.33,8.8 38.23,8.86 39.5,8.86 | 18.22,7.11 | 18.22,7.11 17.75,7.59 | T1.2 17.26,8.08 17.75,7.59 | 17.75,7.59 | v16.48,6.95 16.48,5.52 16.95,5.05 17.75,5.05 | 16.8,19.34 | 16.8,19.34 10.92,13.46 10.92,11.72 10.92,10.92 10.45,10.45 v9.33,10.45 | 19.65,28.07 | 19.65,28.07 C13.2 20.13,28.07 | 19.02,27.91 20.92,29.81 20.29,27.91 20.13,28.07 | 20.13,28.07 19.97,28.23
  Bottom 0.813: IC2.1 25.37,39.97 26.32,40.93 36.48,40.93 JP2.6 | 54.1,15.84 54.1,16.16 | C8.2 49.18,12.35 48.74,11.91 SJ3.1
  pour Bottom (isolate 0.305, rank 2): 22.51,43.15 58.39,43.15 58.39,-1.3 8.86,-1.3 8.86,12.35 13.3,16.8 13.3,22.35 22.51,31.56
LED_ERROR  (via drill 0.4)
  Top 0.305: R13.1 26.95,28.7 v26.96,27.59
  Bottom 0.305: IC1.57 27.03,27.51
  Bottom 0.406: 27.03,27.51 v26.96,27.59
LED_OK  (via drill 0.4)
  Top 0.305: 29.34,28.54 30.13,29.34 R14.1 | 29.34,28.54 28.86,28.07 v28.7,28.07 | 29.34,28.54
  Bottom 0.305: IC1.58 27.82,27.18 v28.7,28.07
LED_PWR
  Bottom 0.305: IC1.32 20.57,9.14 19.34,7.91 19.34,7.59 R2.1
LED_RX1
  Bottom 0.406: IC1.19 31.04,8.43 32.35,7.11 R3.1
LED_RX2
  Bottom 0.406: IC1.18 31.84,8.74 32.83,7.75 33.62,7.75 34.26,7.11 LED2.K
LED_TX1
  Bottom 0.406: IC1.17 32.81,9.67 33.78,8.7 34.73,7.75 36.48,6 R4.1
LED_TX2
  Bottom 0.406: IC1.16 34.64,9.11 36.16,7.59 39.02,7.59 39.34,7.27 LED3.K
MISO
  Bottom 0.305: IC1.3 35.41,22.08 36.72,23.38 36.72,25.45 35.69,26.48 35.69,30.29 34.89,31.08 34.89,34.26 32.99,36.16 JP2.1
N$1  (via drill 0.4)
  Top 0.305: v32.83,32.04 32.99,32.04 33.46,32.51 33.46,33.78 35.05,35.37 37.75,35.37 38.07,35.69 JP2.5
  Bottom 0.305: SJ1.2 30.92,32.99 31.88,32.04 v32.83,32.04
N$2  (via drill 0.8)
  Top 0.813: v47.28,14.73 47.28,17.43 48.55,18.7 48.7,18.7 48.71,18.7 X1.1
  Bottom 0.813: L1.1 46.64,14.1 v47.28,14.73 | v47.28,14.73
N$3
  Top 0.406: R16.2 24.89,17.43 23.3,19.02 C22.2 | T2.4 25.69,15.21 25.37,15.53 R16.2 | R16.2
N$4
  Bottom 0.305: IC1.4 33.41,21.29 33.15,21.56 33.15,23.86 33.62,24.34 34.26,24.97 34.26,29.81 33.62,30.45 33.62,33.62 32.83,34.42 30.13,34.42 | 30.13,34.42 SJ1.3 | 30.13,34.42
N$5  (via drill 0.5)
  Top 0.406: v8.86,22.83 REL1.4
  Bottom 0.406: R12.2 v8.86,22.83
N$6  (via drill 0.6)
  Top 0.406: REL1.8 16.48,16.48
  Top 0.61: v16.48,14.57 REL1.8
  Bottom 0.61: 12.51,12.35 12.51,12.19 | T1.3 14.26,9.49 14.26,10.45 12.51,12.19 | 12.51,12.19 | v16.48,14.57 13.78,14.57 12.51,13.3 12.51,12.35 | D1.A 12.51,12.35
N$7
  Bottom 0.61: T1.1 16.48,10.44 16.16,10.76 15.68,10.76 14.57,11.87 14.57,12.51 | 14.57,12.51 | R1.2 14.57,12.51
N$8
  Bottom 0.406: IC1.23 27.82,7.36 28.23,6.95 29.34,6.95 | 29.34,6.95 Q2.2 | C2.1 29.55,6.74 29.34,6.95
N$9
  Bottom 0.406: R1.1 16.95,12.83 17.55,13.42 IC1.35
N$10
  Bottom 0.406: IC1.24 27.03,7.35 26.64,6.95 24.57,6.95 | Q2.1 24.57,6.95 | C1.1 24.36,6.74 24.57,6.95
N$11  (via drill 0.4)
  Top 0.305: IC6.28 37.67,18.15 40.29,15.53 | 40.29,15.53 Q1.2 | v40.29,14.57 40.29,15.53
  Bottom 0.406: C4.1 40.29,12.99 v40.29,14.57
N$12
  Top 0.305: R13.2 27.43,31.88 LED4.A
N$13  (via drill 0.4)
  Top 0.305: 36.32,15.05 v37.75,15.05 36.32,15.05 | 36.32,15.05 35.85,15.53 Q1.1 | 36.32,15.05 36,15.37 36,16 36.87,16.87 IC6.27
  Bottom 0.305: v37.75,15.05 38.07,14.73 38.07,10.76 38.23,10.6 C3.1
N$14
  Top 0.305: R14.2 30.77,31.88 31.88,30.77 LED5.A
N$15
  Bottom 0.406: R2.2 20.61,3.78 LED1.A
N$16  (via drill 0.4)
  Top 0.305: v26,28.07 26,28.86 25.05,29.81 25.05,31.72 25.37,32.04 26.48,32.04 27.59,33.15 32.19,33.15 LED5.K
  Bottom 0.305: IC1.55 25.44,27.5 v26,28.07
N$17  (via drill 0.4)
  Top 0.305: v25.05,28.54 24.42,29.18 24.42,32.67 25.05,33.31 LED4.K
  Bottom 0.305: IC1.54 24.64,28.13 v25.05,28.54
N$18  (via drill 0.5)
  Top 0.406: v11.08,27.27 IC5.8
  Bottom 0.406: v11.08,27.27 10.76,26.96 R11.2
N$19
  Bottom 1.016: X1.S2 53.45,23.77 53.47,23.78 52.04,25.21 SJ2.1
N$20
  Bottom 0.813: X1.S1 53.34,11.37 53.31,11.4 52.04,10.13 SJ3.2
N$21  (via drill 0.8)
  Top 0.813: v46.8,10.29 46.64,10.13 F1.1
  Bottom 0.813: L1.2 46.64,10.45 v46.8,10.29 45.53,10.29 45.05,9.81 C7.1
N$22
  Bottom 0.61: 17.75,36.64 C15.1
  Bottom 0.813: 17.75,38.86 IC2.4 17.75,36.64 17.75,35.21 17.59,35.05 L2.2
N$23
  Top 0.305: IC6.32 40.87,20.39 41.08,20.61 47.12,20.61 47.91,21.4 | 47.91,21.4 | 47.91,21.4 48.07,21.56 48.07,25.37 44.42,29.02 44.42,30.29 44.32,30.39 IC8.1
N$24
  Top 0.305: IC6.1 46.86,21.3 47.43,21.88 47.43,25.05 45.53,26.96 | 45.53,26.96 | 45.53,26.96 42.67,29.81 42.67,31.4 42.99,31.72 IC8.2
N$25  (via drill 0.4)
  Top 0.406: IC8.4 42.67,34.26 v41.4,32.99
  Bottom 0.406: R9.2 v41.4,32.99 | R9.2 39.66,32.99 R9.2 | R10.1 R9.2
N$26  (via drill 0.4)
  Top 0.305: IC6.2 46.39,22.1 46.8,22.51 46.8,24.73 42.04,29.5 42.04,30.92 v41.88,31.08
  Top 0.406: IC8.3 43.15,32.99 41.88,31.72 v41.88,31.08
  Bottom 0.406: R9.1 41.72,31.09 v41.88,31.08
N$27
  Bottom 0.305: IC1.11 35.78,15.78 37.43,17.43 37.43,21.24 38.39,22.19 38.39,25.69 39.18,26.48 39.18,27.59 38.86,27.91 36.64,27.91 36.32,28.23 36.32,30.61 35.53,31.4 JP2.3
N$28  (via drill 0.4)
  Top 0.305: v42.67,17.11 39.66,17.11 39.27,17.5 IC6.30
  Bottom 0.305: v42.67,17.11 42.35,16.8 42.35,13.46 42.2,12.83 | 42.2,12.83 R5.1 | C5.1 40.93,10.92 42.2,12.19 42.2,12.83 | 42.2,12.83
N$29
  Bottom 0.305: JP2.4 34.26,38.07 32.35,38.07 31.72,37.43 31.72,36.48 34.26,33.94 34.26,30.77 35.05,29.97 35.05,26.16 36.08,25.13 36.08,23.54 35.41,22.87 IC1.2
N$30
  Bottom 0.406: C12.1 29.97,27.91 30.97,26.91 IC1.62
N$31  (via drill 0.4)
  Top 0.305: IC6.8 43.68,26.9 45.69,24.89 v45.69,24.42
  Bottom 0.305: 48.7,23.94 R7.2 | v45.69,24.42 48.23,24.42 48.7,23.94 | 48.7,23.94
N$32  (via drill 0.4)
  Top 0.305: IC6.7 43.53,26.1 v43.94,25.69
  Bottom 0.305: R6.2 54.26,19.34 53.78,19.81 | 53.78,19.81 | 53.78,19.81 53.63,19.97 50.45,19.97 50.13,20.29 50.13,26.16 48.86,27.43 48.86,28.38 48.07,29.18 46.64,29.18 43.94,26.64 v43.94,25.69 43.94,26.95 R8.1
N$33
  Bottom 0.406: R4.2 37.75,3.78 LED3.A
N$34
  Bottom 0.406: R3.2 32.67,3.78 LED2.A
N$37  (via drill 0.4)
  Top 0.305: IC6.5 43.22,24.5 43.62,24.1 v43.62,23.94
  Bottom 0.305: R8.2 42.2,25.21 43.47,23.94 v43.62,23.94
N$38  (via drill 0.4)
  Top 0.406: IC6.6 43.22,25.3 43.78,24.73 v44.26,24.73
  Bottom 0.406: v44.26,24.73 44.42,24.73 45.69,26 46.01,26 C10.2
PWREN  (via drill 0.4)
  Top 0.305: R16.1 27.27,17.43 27.59,17.75 v28.7,17.75 | v27.43,24.1 31.4,28.07 33.31,28.07 34.73,29.5 39.81,29.5 40.07,29.24 IC6.10
  Bottom 0.305: v28.7,17.75 29.97,19.02 29.97,23.78 29.34,24.42 27.75,24.42 v27.43,24.1
RESET  (via drill 0.4)
  Top 0.305: R15.2 30.76,35.21 30.77,35.21 | R15.2 28.54,35.21 | 28.54,35.21 C18.1 | R15.2 28.55,35.21 28.54,35.21 | 28.54,35.21 28.38,35.21 27.75,34.58 v27.43,34.26
  Bottom 0.305: 29.65,30.92 30.61,30.92 31.88,29.65 33.15,29.65 33.62,29.18 33.62,28.07 33.62,25.13 32.51,24.02 32.51,20.92 33.15,20.29 33.15,14.73 30.24,11.82 IC1.20 | v27.43,34.26 27.43,34.1 27.43,31.24 27.75,30.92 29.65,30.92 | 29.65,30.92 SJ1.1
RXCAN  (via drill 0.4)
  Top 0.305: IC7.2 19.02,24.73 18.38,24.1 18.38,9.97 20.29,8.06 v20.29,7.75 | v20.29,7.75
  Bottom 0.305: IC1.31 21.36,8.66 20.29,7.59 v20.29,7.75
SW1  (via drill 0.4)
  Top 0.305: JP1.2 49.02,29.34 49.02,27.43 49.97,26.48 49.97,21.72 52.04,19.65 52.04,15.21 50.45,13.62 33.94,13.62 33.46,13.14 v32.99,13.14 | JP1.2 | JP1.2 JP4.1
  Bottom 0.406: IC1.14 33.19,13.35 v32.99,13.14
SW2  (via drill 0.4)
  Top 0.305: JP1.4 50.13,27.59 50.61,27.11 50.61,22.03 52.67,19.97 52.67,14.89 50.77,12.99 36.64,12.99 v36.32,12.67 | JP1.4 | JP1.4 | JP1.4 | JP1.4 JP4.2
  Bottom 0.406: v36.32,12.67 | IC1.15 36.2,12.55 v36.32,12.67
TXCAN  (via drill 0.4)
  Top 0.305: IC7.3 20.29,25.05 19.02,23.78 19.02,10.29 19.34,9.97 20.76,8.54 21.24,8.06 v21.24,7.27
  Bottom 0.305: v21.24,7.27 21.24,7.59 22.15,8.5 IC1.30
V+  (via drill 0.6)
  Top 0.406: IC5.3 13.94,29.81 13.3,30.45 13.3,32.99 | IC7.8 17.75,32.99 v15.53,32.99 13.3,32.99 | 13.3,32.99 C17.1
  Bottom 0.813: C16.1 19.65,32.99 17.75,32.99 | 17.75,32.99 L2.1 | 17.75,32.99 16.95,32.99 v15.53,32.99
VCC  (via drill 0.4)
  Top 0.305: 42.2,23.62 42.27,23.7 IC6.4 | 39.27,26.39 39.27,26.41 | 42.28,22.9 IC6.3 42.27,22.9 42.2,22.99 42.28,22.9
  Top 0.406: 27.27,13.94 28.07,13.94 31.24,17.11 35.69,17.11 36.07,17.49 IC6.26 36.07,20.83 37.27,22.03 40.45,22.03 41.4,22.99 | IC6.11 39.27,26.41 39.02,26.16 37.91,26.16 37.67,26.4 IC6.13 | 41.4,22.99 42.2,22.99 | 41.4,23.62 42.2,23.62 | 41.4,23.62 41.08,23.94 41.08,25.37 | 41.08,25.37 41.08,26.16 | 41.08,26.16 | 41.08,26.16 39.5,26.16 39.27,26.39 | 41.08,26.16 41.08,27.11 41.56,27.59 41.56,29.02 41.24,29.34 41.24,30.13 40.93,30.45 IC8.8 37.43,30.45 36.48,31.4 | 41.4,22.99 41.4,23.62 | 41.4,23.62 | IC6.3 43.22,22.9 v43.47,22.99 | 36.48,31.4 | 36.48,31.4 C19.1 | 41.08,25.37 41.08,25.69 v40.93,25.84 | v40.93,25.84
  Top 0.61: T2.1 27.27,11.4 27.27,12.67 | T2.3 27.27,13.94 27.27,12.67 | 27.27,12.67 27.27,11.72 | F1.2 34.26,10.13 31.72,12.67 30.92,12.67 | 27.27,12.67 T2.2 | 27.27,12.67 30.92,12.67 | 30.92,12.67 C20.1
  Bottom 0.406: 45.21,15.84 45.21,15.05 44.1,13.94 44.1,12.67 | v43.47,22.99 | v43.47,22.99 43.31,22.83 43.31,17.75 45.21,15.84 | 46.16,15.84 IC4.14 45.21,15.84 | 44.1,12.67 R5.2 | 44.1,12.67 44.1,12.51 42.99,11.4 C6.1 | R10.2 37.59,29.65 37.91,29.34 40.77,29.34 41.08,29.02 | 42.3,29.6 C11.1 42.3,29.55 42.2,29.02 41.08,29.02 | 41.08,29.02 41.08,26 v40.93,25.84 | 41.08,29.02

### Text on the board
Top: v1.3 | top | USB2CAN
Bottom: (c) Fabian Greif | bot
tPlace: Program | Taster
tNames: Status | TX | RX
Eagle3D: 6 15 | 1 15 | 7 100 | V4 -10 | 5 6 | V3 0 | 2 4 | V1 0 | 4 5 | V2 0 | 3 8